# EAGLE design ppcb (EAGLE 6.2)
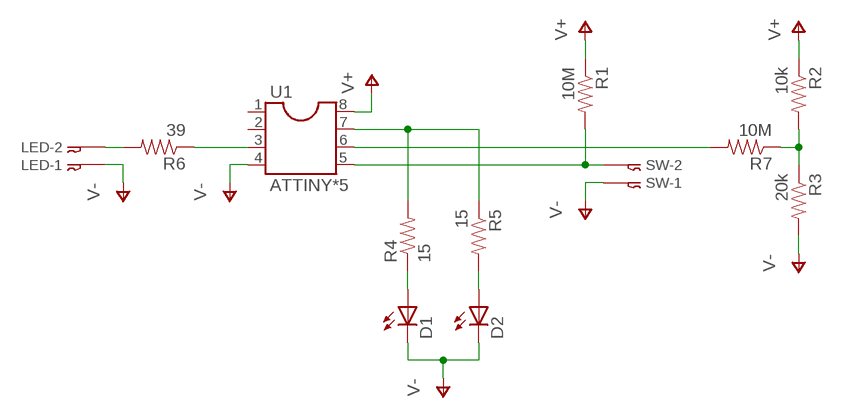
[diagram p0: schematic, sheet 1]

## Parts
D1  LED5MM  [LED5MM]
D2  LED5MM  [LED5MM]
LED  02-JST  [B2B-XH]
R1  10M  RESISTORPTH-1/4W  [AXIAL-0.4]
R2  10k  RESISTORPTH-1/4W  [AXIAL-0.4]
R3  20k  RESISTORPTH-1/4W  [AXIAL-0.4]
R4  15  RESISTORPTH-1/4W  [AXIAL-0.4]
R5  15  RESISTORPTH-1/4W  [AXIAL-0.4]
R6  39  RESISTORPTH-1/4W  [AXIAL-0.4]
R7  10M  RESISTORPTH-1/4W  [AXIAL-0.4]
SW  02-JST  [B2B-XH]
U1  ATTINY*5  DIL8S  [SOCKET-08]

## Nets
N$1: R1.P$2 SW.P$2 U1.5
N$2: R7.P$2 U1.6
N$3: LED.P$2 R6.P$2
N$4: D1.A R4.P$1
N$5: R2.P$2 R3.P$1 R7.P$1
N$6: D2.A R5.P$2
N$7: R6.P$1 U1.3
N$9: R4.P$2 R5.P$1 U1.7
V+: R1.P$1 R2.P$1 U1.8
V-: D1.K(C) D2.K(C) LED.P$1 R3.P$2 SW.P$1 U1.4
Unconnected: U1.1 U1.2

## Library data of the parts
D1 D2 = SparkFun-LED:LED: LEDs Standard schematic elements and footprints for 5mm, 3mm, 1206, and 0603 sized LEDs. 5mm - Spark Fun Electronics SKU : COM-00529 (and others)
LED SW = con-jst-xh:02-JST
R1-R7 = SparkFun-Resistors:RESISTOR: Resistor Basic schematic elements and footprints for 0603, 1206, and PTH resistors.
U1 = ic-package:DIL8: Dual In Line / Socket

## Board
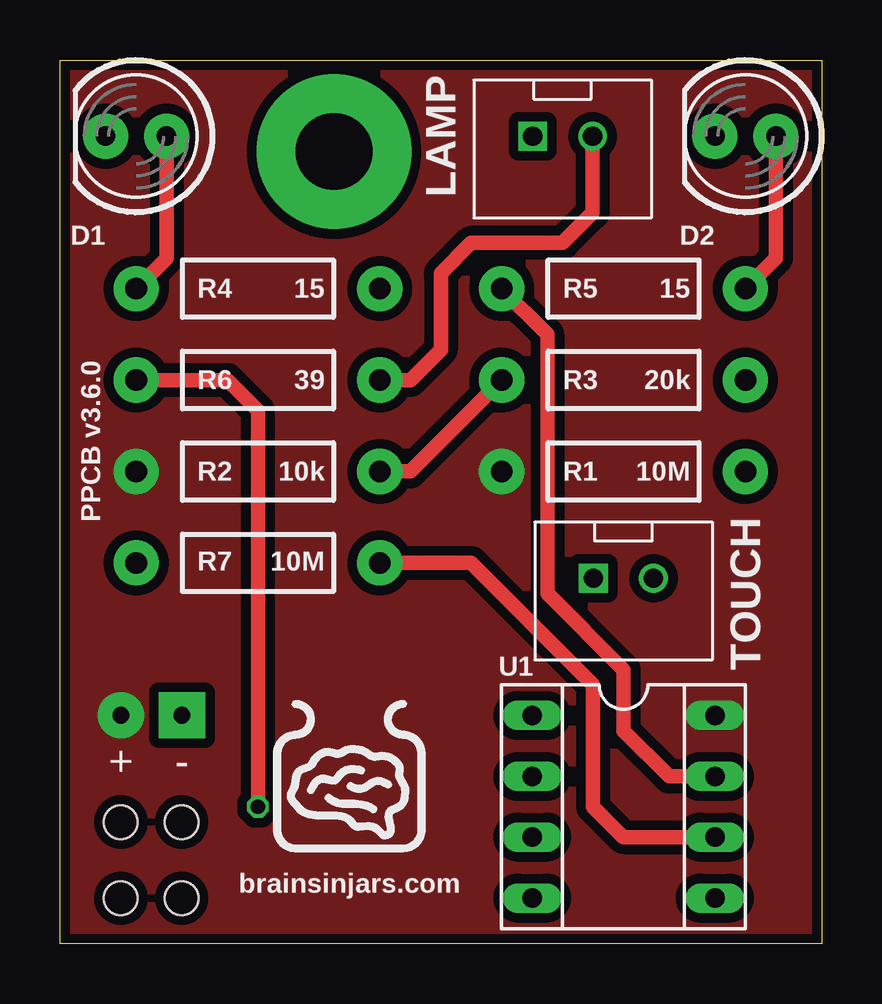
[diagram p1: board, top side]
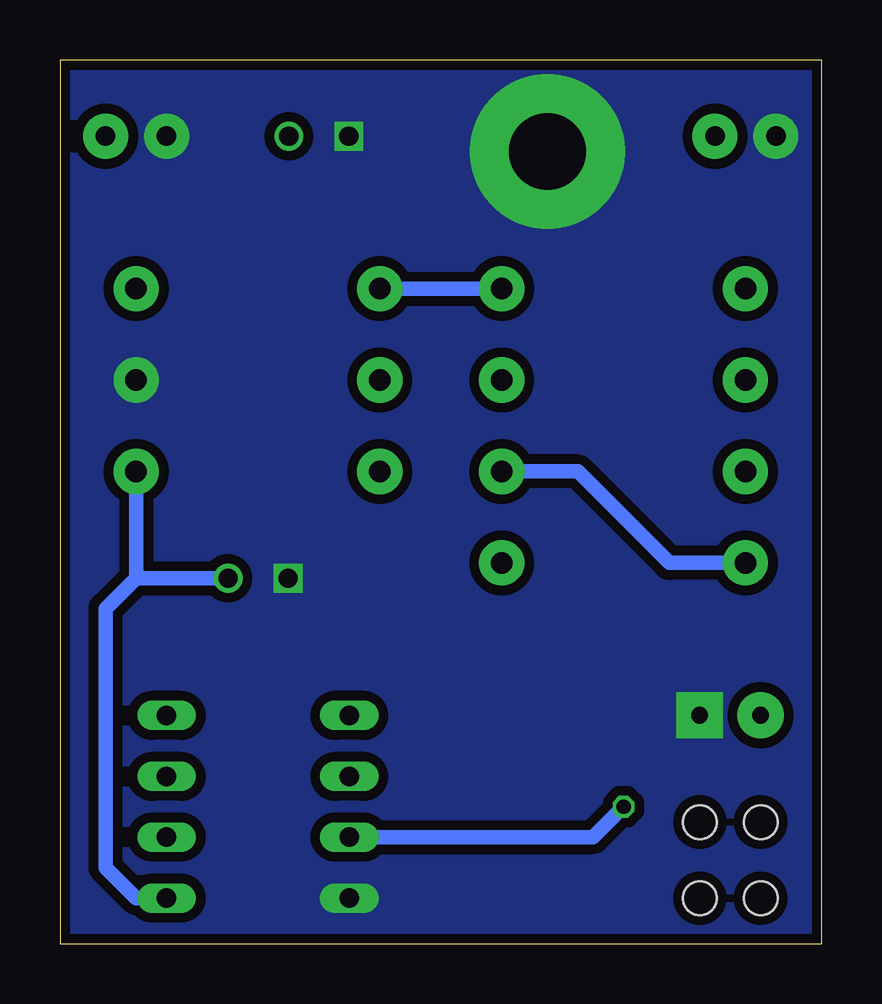
[diagram p2: board, bottom side, seen from below]

Size 31.75 x 36.83 mm. Coordinates in mm from the lower left corner, seen from the top.
Outline: 31.75,36.83 31.75,0 0,0 0,36.83 31.75,36.83
Copper layers (1*2*15*16): Top 0.035mm / dielectric 0.2mm / layer 2 0.0175mm / dielectric 1.1mm / layer 15 0.0175mm / dielectric 0.2mm / Bottom 0.035mm
Design rules: minimum track width 6mil, minimum drill 12mil, track to track 6mil, track to pad 6mil, pad to pad 6mil, via to via 6mil, smd to smd 0mil, copper to edge 10mil, drill to drill 10mil, minimum pad ring 6mil, minimum via ring 6mil, stop-mask expansion 2mil, vias tented up to drill 25mil, thermal gap 10mil
Holes 1.4 mm at 2.54,5.08 5.08,5.08 2.54,1.91 5.08,1.91

### Footprints (pad centres in the part's own frame; a part is rotated, then mirrored left to right if it is on the bottom)
LED5MM = drill 0.813 pad 1.88: A -1.27,0; K 1.27,0
B2B-XH = drill 0.8 square: P$1 -1.25,0 | drill 0.8: P$2 1.25,0
AXIAL-0.4 = drill 0.9 pad 1.88: P$1 -5.08,0; P$2 5.08,0
SOCKET-08 = drill 0.813 long: 1 -3.81,-3.81; 2 -1.27,-3.81; 3 1.27,-3.81; 4 3.81,-3.81; 5 3.81,3.81; 6 1.27,3.81; 7 -1.27,3.81; 8 -3.81,3.81

### Placement (x,y rotation side)
D1  3.17,33.66 180 top
D2  28.57,33.66 180 top
LED  20.95,33.66 0 top
R1  23.5,19.68 0 top
R2  8.26,19.68 0 top
R3  23.5,23.5 0 top
R4  8.26,27.3 0 top
R5  23.5,27.3 0 top
R6  8.26,23.5 0 top
R7  8.26,15.88 0 top
SW  23.5,15.24 0 top
U1  23.5,5.71 270 top
U$2  [LOGO-1_4_IN]  12.06,6.99 0 top

### Tracks (layer width: path | path; a pad name or v marks a point on that pad's centre or on a via)
N$1
  Bottom 0.61: U1.5 28.57,1.91 29.84,3.17 29.84,13.97 28.57,15.24 | 28.57,15.24 SW.P$2 | R1.P$2 28.57,15.24
N$2
  Top 0.61: R7.P$2 17.14,15.88 22.23,10.79 22.23,5.71 23.5,4.45 U1.6
N$3
  Top 0.61: R6.P$2 14.61,23.5 15.88,24.77 15.88,27.94 17.14,29.21 20.95,29.21 22.2,30.46 LED.P$2
N$4
  Top 0.61: D1.A 4.45,28.57 R4.P$1
N$5
  Top 0.61: R2.P$2 14.61,19.68 R3.P$1
  Bottom 0.61: R7.P$1 6.35,15.88 10.16,19.68 R2.P$2
N$6
  Top 0.61: D2.A 29.84,28.57 R5.P$2
N$7  (via drill 0.6)
  Top 0.61: v8.26,5.71 8.26,22.23 6.99,23.5 R6.P$1
  Bottom 0.61: U1.3 9.53,4.45 v8.26,5.71
N$9
  Top 0.61: R5.P$1 20.32,25.4 20.32,14.61 23.5,11.43 23.5,8.89 25.4,6.99 U1.7
  Bottom 0.61: R5.P$1 R4.P$2
V+  (via drill 0.7 pad 1.93)
  other vias: 2.54,9.53
  pour Top (isolate 0.406, no thermals): 31.75,36.83 0,36.83 0,0 31.75,0
V-  (via drill 0.7 pad 1.93, 3.2 pad 6.45)
  other vias: 11.43,33.02 5.08,9.53
  pour Bottom (isolate 0.406, no thermals): 31.75,36.83 0,36.83 0,0 31.75,0

### Text on the board
tPlace: LAMP | PPCB v3.6.0 | TOUCH | + | - | brainsinjars.com
tDocu: http://brainsinjars.com